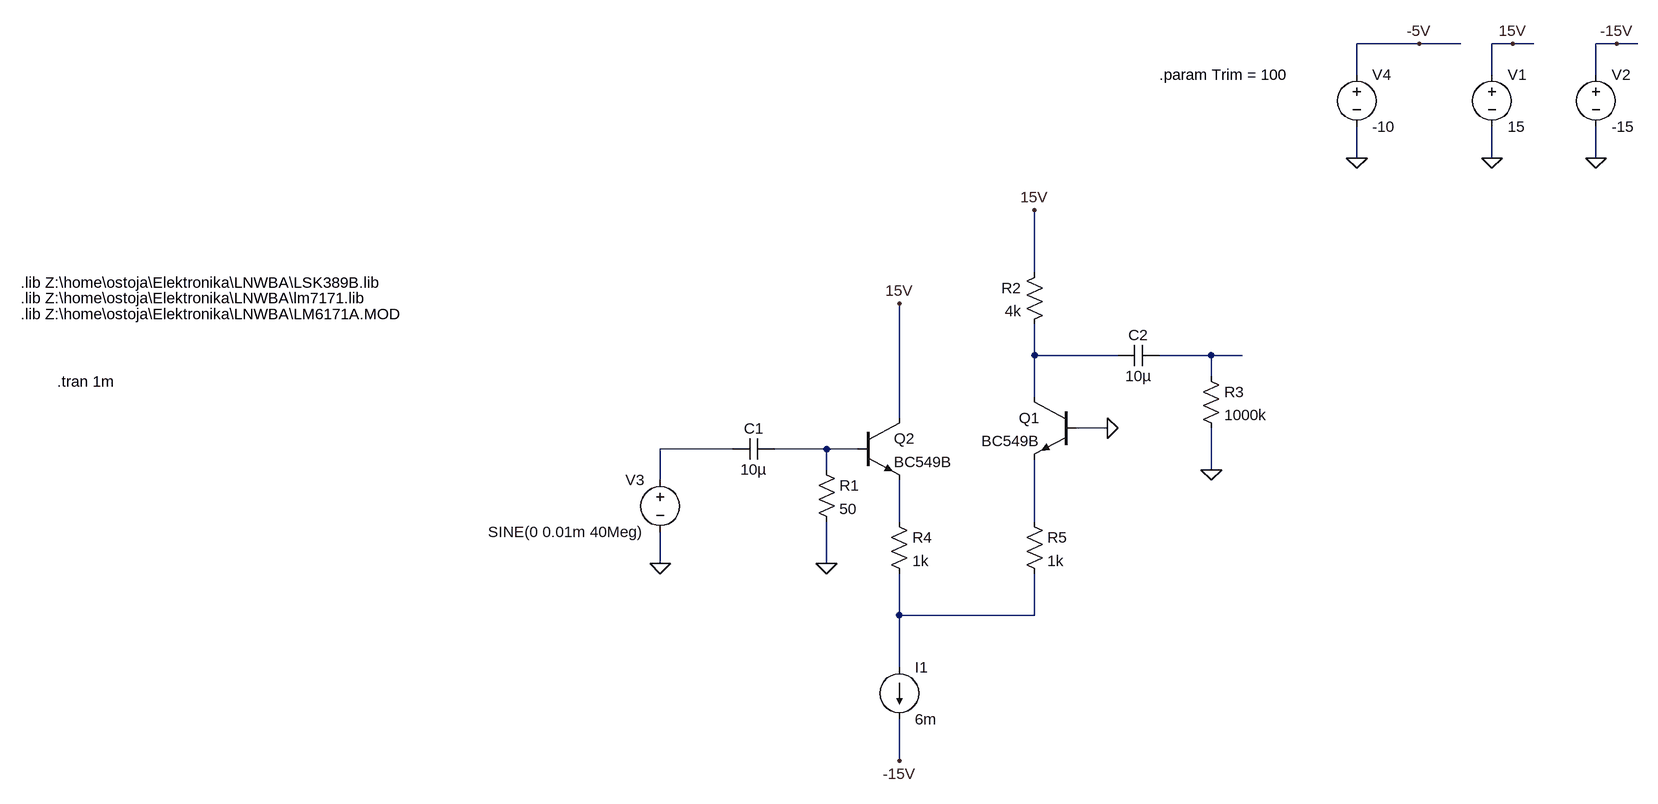
[diagram p0: schematic LNWBA_bjt.asc]
LNWBA_bjt.asc, the LTspice schematic file:
Version 4
SHEET 1 2516 820
WIRE 960 -592 864 -592
WIRE 1024 -592 960 -592
WIRE 1104 -592 1072 -592
WIRE 1136 -592 1104 -592
WIRE 1264 -592 1232 -592
WIRE 1296 -592 1264 -592
WIRE 864 -544 864 -592
WIRE 1072 -544 1072 -592
WIRE 1232 -544 1232 -592
WIRE 864 -416 864 -464
WIRE 1072 -416 1072 -464
WIRE 1232 -416 1232 -464
WIRE 368 -240 368 -336
WIRE 368 -112 368 -160
WIRE 496 -112 368 -112
WIRE 640 -112 560 -112
WIRE 688 -112 640 -112
WIRE 640 -80 640 -112
WIRE 368 -48 368 -112
WIRE 160 -16 160 -192
WIRE 480 0 432 0
WIRE -96 32 -208 32
WIRE 48 32 -32 32
WIRE 96 32 48 32
WIRE 48 64 48 32
WIRE 640 64 640 0
WIRE -208 80 -208 32
WIRE 160 144 160 80
WIRE 368 144 368 48
WIRE -208 208 -208 160
WIRE 48 208 48 144
WIRE 160 288 160 224
WIRE 368 288 368 224
WIRE 368 288 160 288
WIRE 160 368 160 288
WIRE 160 512 160 448
FLAG 1104 -592 15V
FLAG 1264 -592 -15V
FLAG 1232 -416 0
FLAG 1072 -416 0
FLAG 368 -336 15V
FLAG 160 512 -15V
FLAG -208 208 0
FLAG 960 -592 -5V
FLAG 864 -416 0
FLAG 48 208 0
FLAG 160 -192 15V
FLAG 480 0 0
FLAG 640 64 0
SYMBOL voltage 1072 -560 R0
WINDOW 123 0 0 Left 0
WINDOW 39 0 0 Left 0
SYMATTR InstName V1
SYMATTR Value 15
SYMBOL voltage 1232 -560 R0
WINDOW 123 0 0 Left 0
WINDOW 39 0 0 Left 0
SYMATTR InstName V2
SYMATTR Value -15
SYMBOL voltage -208 64 M0
WINDOW 123 0 0 Left 0
WINDOW 39 0 0 Left 0
SYMATTR InstName V3
SYMATTR Value SINE(0 0.01m 40Meg)
SYMBOL res 384 -256 M0
SYMATTR InstName R2
SYMATTR Value 4k
SYMBOL voltage 864 -560 R0
WINDOW 123 0 0 Left 0
WINDOW 39 0 0 Left 0
SYMATTR InstName V4
SYMATTR Value -10
SYMBOL cap -32 16 R90
WINDOW 0 0 32 VBottom 2
WINDOW 3 32 32 VTop 2
SYMATTR InstName C1
SYMATTR Value 10µ
SYMBOL res 32 48 R0
SYMATTR InstName R1
SYMATTR Value 50
SYMBOL npn 96 -16 R0
SYMATTR InstName Q2
SYMATTR Value BC549B
SYMBOL npn 432 -48 M0
SYMATTR InstName Q1
SYMATTR Value BC549B
SYMBOL current 160 368 R0
WINDOW 123 0 0 Left 0
WINDOW 39 0 0 Left 0
SYMATTR InstName I1
SYMATTR Value 6m
SYMBOL cap 560 -128 R90
WINDOW 0 0 32 VBottom 2
WINDOW 3 32 32 VTop 2
SYMATTR InstName C2
SYMATTR Value 10µ
SYMBOL res 624 -96 R0
SYMATTR InstName R3
SYMATTR Value 1000k
SYMBOL res 352 128 R0
SYMATTR InstName R5
SYMATTR Value 1k
SYMBOL res 144 128 R0
SYMATTR InstName R4
SYMATTR Value 1k
TEXT -1192 -224 Left 2 !.lib Z:\\home\\ostoja\\Elektronika\\LNWBA\\LSK389B.lib
TEXT -1136 -72 Left 2 !.tran 1m
TEXT -1192 -200 Left 2 !.lib Z:\\home\\ostoja\\Elektronika\\LNWBA\\lm7171.lib
TEXT -1192 -176 Left 2 !.lib Z:\\home\\ostoja\\Elektronika\\LNWBA\\LM6171A.MOD
TEXT 560 -544 Left 2 !.param Trim = 100

The netlist it stands for:
* LNWBA_bjt.asc
V1 15V 0 15
V2 -15V 0 -15
V3 N003 0 SINE(0 0.01m 40Meg)
R2 15V N001 4k
V4 -5V 0 -10
C1 N004 N003 10µ
R1 N004 0 50
Q2 15V N004 N005 0 BC549B
Q1 N001 0 N006 0 BC549B
I1 N007 -15V 6m
C2 N002 N001 10µ
R3 N002 0 1000k
R5 N006 N007 1k
R4 N005 N007 1k
.model NPN NPN
.model PNP PNP
.lib standard.bjt
.lib Z:\home\ostoja\Elektronika\LNWBA\LSK389B.lib
.tran 1m
.lib Z:\home\ostoja\Elektronika\LNWBA\lm7171.lib
.lib Z:\home\ostoja\Elektronika\LNWBA\LM6171A.MOD
.param Trim = 100
.backanno
.end